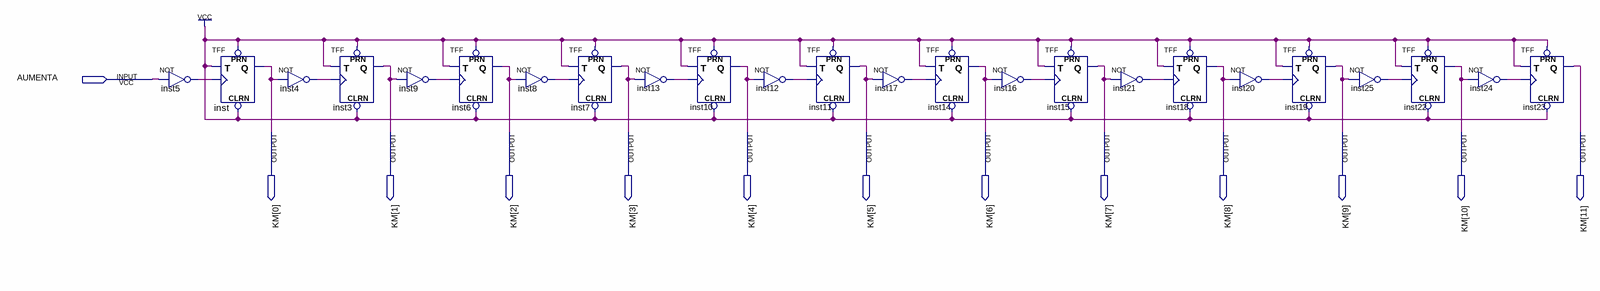
[diagram p0: schematic sheet]
// Quartus schematic km.bdf as structural Verilog: 24 symbols, 13 pins
module km (
  input  AUMENTA,
  output [11:0] KM
);

  wire inst4_out, inst5_out, inst8_out, inst9_out, inst12_out, inst13_out, inst16_out, inst17_out,
       inst20_out, inst21_out, inst24_out, inst25_out;

  not inst5 (inst5_out, AUMENTA);
  TFF inst (.PRN(1'b1), .CLRN(1'b1), .T(1'b1), .CLK(inst5_out), .Q(KM[0]));
  not inst4 (inst4_out, KM[0]);
  TFF inst3 (.PRN(1'b1), .CLRN(1'b1), .T(1'b1), .CLK(inst4_out), .Q(KM[1]));
  not inst9 (inst9_out, KM[1]);
  TFF inst6 (.PRN(1'b1), .CLRN(1'b1), .T(1'b1), .CLK(inst9_out), .Q(KM[2]));
  not inst8 (inst8_out, KM[2]);
  TFF inst7 (.PRN(1'b1), .CLRN(1'b1), .T(1'b1), .CLK(inst8_out), .Q(KM[3]));
  not inst13 (inst13_out, KM[3]);
  TFF inst10 (.PRN(1'b1), .CLRN(1'b1), .T(1'b1), .CLK(inst13_out), .Q(KM[4]));
  not inst12 (inst12_out, KM[4]);
  TFF inst11 (.PRN(1'b1), .CLRN(1'b1), .T(1'b1), .CLK(inst12_out), .Q(KM[5]));
  not inst17 (inst17_out, KM[5]);
  TFF inst14 (.PRN(1'b1), .CLRN(1'b1), .T(1'b1), .CLK(inst17_out), .Q(KM[6]));
  not inst16 (inst16_out, KM[6]);
  TFF inst15 (.PRN(1'b1), .CLRN(1'b1), .T(1'b1), .CLK(inst16_out), .Q(KM[7]));
  not inst21 (inst21_out, KM[7]);
  TFF inst18 (.PRN(1'b1), .CLRN(1'b1), .T(1'b1), .CLK(inst21_out), .Q(KM[8]));
  not inst20 (inst20_out, KM[8]);
  TFF inst19 (.PRN(1'b1), .CLRN(1'b1), .T(1'b1), .CLK(inst20_out), .Q(KM[9]));
  not inst25 (inst25_out, KM[9]);
  TFF inst22 (.PRN(1'b1), .CLRN(1'b1), .T(1'b1), .CLK(inst25_out), .Q(KM[10]));
  not inst24 (inst24_out, KM[10]);
  TFF inst23 (.PRN(1'b1), .CLRN(1'b1), .T(1'b1), .CLK(inst24_out), .Q(KM[11]));
endmodule
